# Altium schematic sheet Daughter_Card_Connectors.SchDoc
size A; SheetNumber: 8; SheetTotal: 8
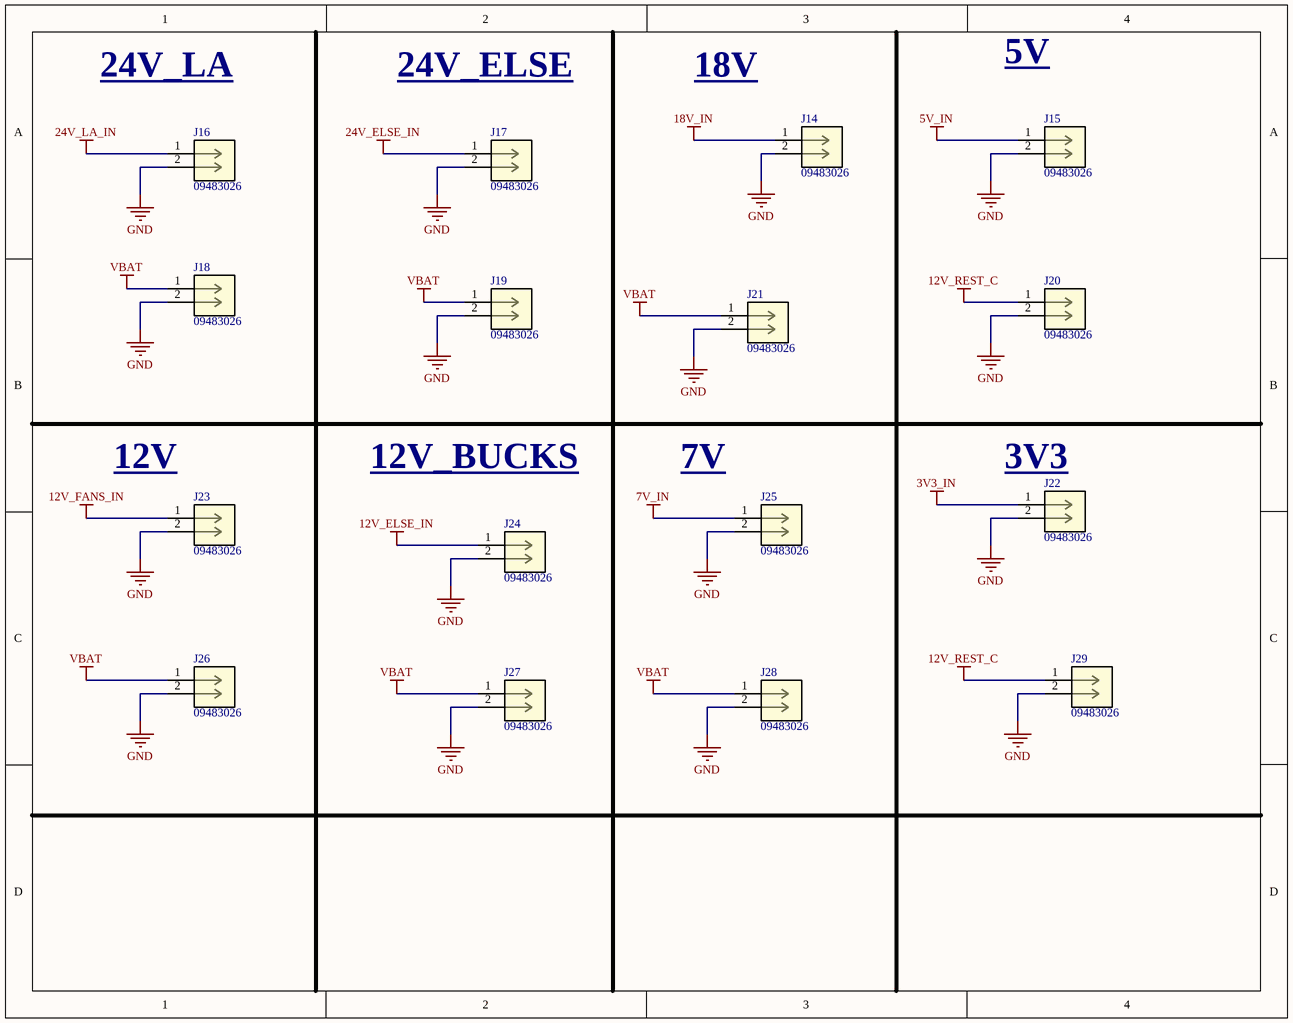
[diagram p0: Daughter_Card_Connectors.SchDoc]

## Parts
J14  09483026  [CONN_SDA-41815_02_TE_H_MOL]
J15  09483026  [CONN_SDA-41815_02_TE_H_MOL]
J16  09483026  [CONN_SDA-41815_02_TE_H_MOL]
J17  09483026  [CONN_SDA-41815_02_TE_H_MOL]
J18  09483026  [CONN_SDA-41815_02_TE_H_MOL]
J19  09483026  [CONN_SDA-41815_02_TE_H_MOL]
J20  09483026  [CONN_SDA-41815_02_TE_H_MOL]
J21  09483026  [CONN_SDA-41815_02_TE_H_MOL]
J22  09483026  [CONN_SDA-41815_02_TE_H_MOL]
J23  09483026  [CONN_SDA-41815_02_TE_H_MOL]
J24  09483026  [CONN_SDA-41815_02_TE_H_MOL]
J25  09483026  [CONN_SDA-41815_02_TE_H_MOL]
J26  09483026  [CONN_SDA-41815_02_TE_H_MOL]
J27  09483026  [CONN_SDA-41815_02_TE_H_MOL]
J28  09483026  [CONN_SDA-41815_02_TE_H_MOL]
J29  09483026  [CONN_SDA-41815_02_TE_H_MOL]

## Nets
3V3_IN: J22.1
5V_IN: J15.1
7V_IN: J25.1
12V_ELSE_IN: J24.1
12V_FANS_IN: J23.1
12V_REST_C: J20.1 J29.1
18V_IN: J14.1
24V_ELSE_IN: J17.1
24V_LA_IN: J16.1
GND: J14.2 J15.2 J16.2 J17.2 J18.2 J19.2 J20.2 J21.2 J22.2 J23.2 J24.2 J25.2 J26.2 J27.2 J28.2 J29.2
VBAT: J18.1 J19.1 J21.1 J26.1 J27.1 J28.1

## Notes on the sheet
- 24V_LA
- 24V_ELSE
- 18V
- 5V
- (near J23) 12V
- 12V_BUCKS
- 7V
- (near J22) 3V3

## Library data of the parts
J14-J29 = CONN-2PIN-0009: KK 396 PC Board Connector, Top Entry, Polyester Connector, Gold (Au) Selective, 2 Circuits; Manufacturer_Name: Molex Connector Corporation; Copyright: Copyright (C) 2025 Ultra Librarian. All rights reserved.; Manufacturer_Part_Number: 09483026; RefDes: RefDes; Type: Type